# EAGLE design RelayDriverShield (EAGLE 5.10)
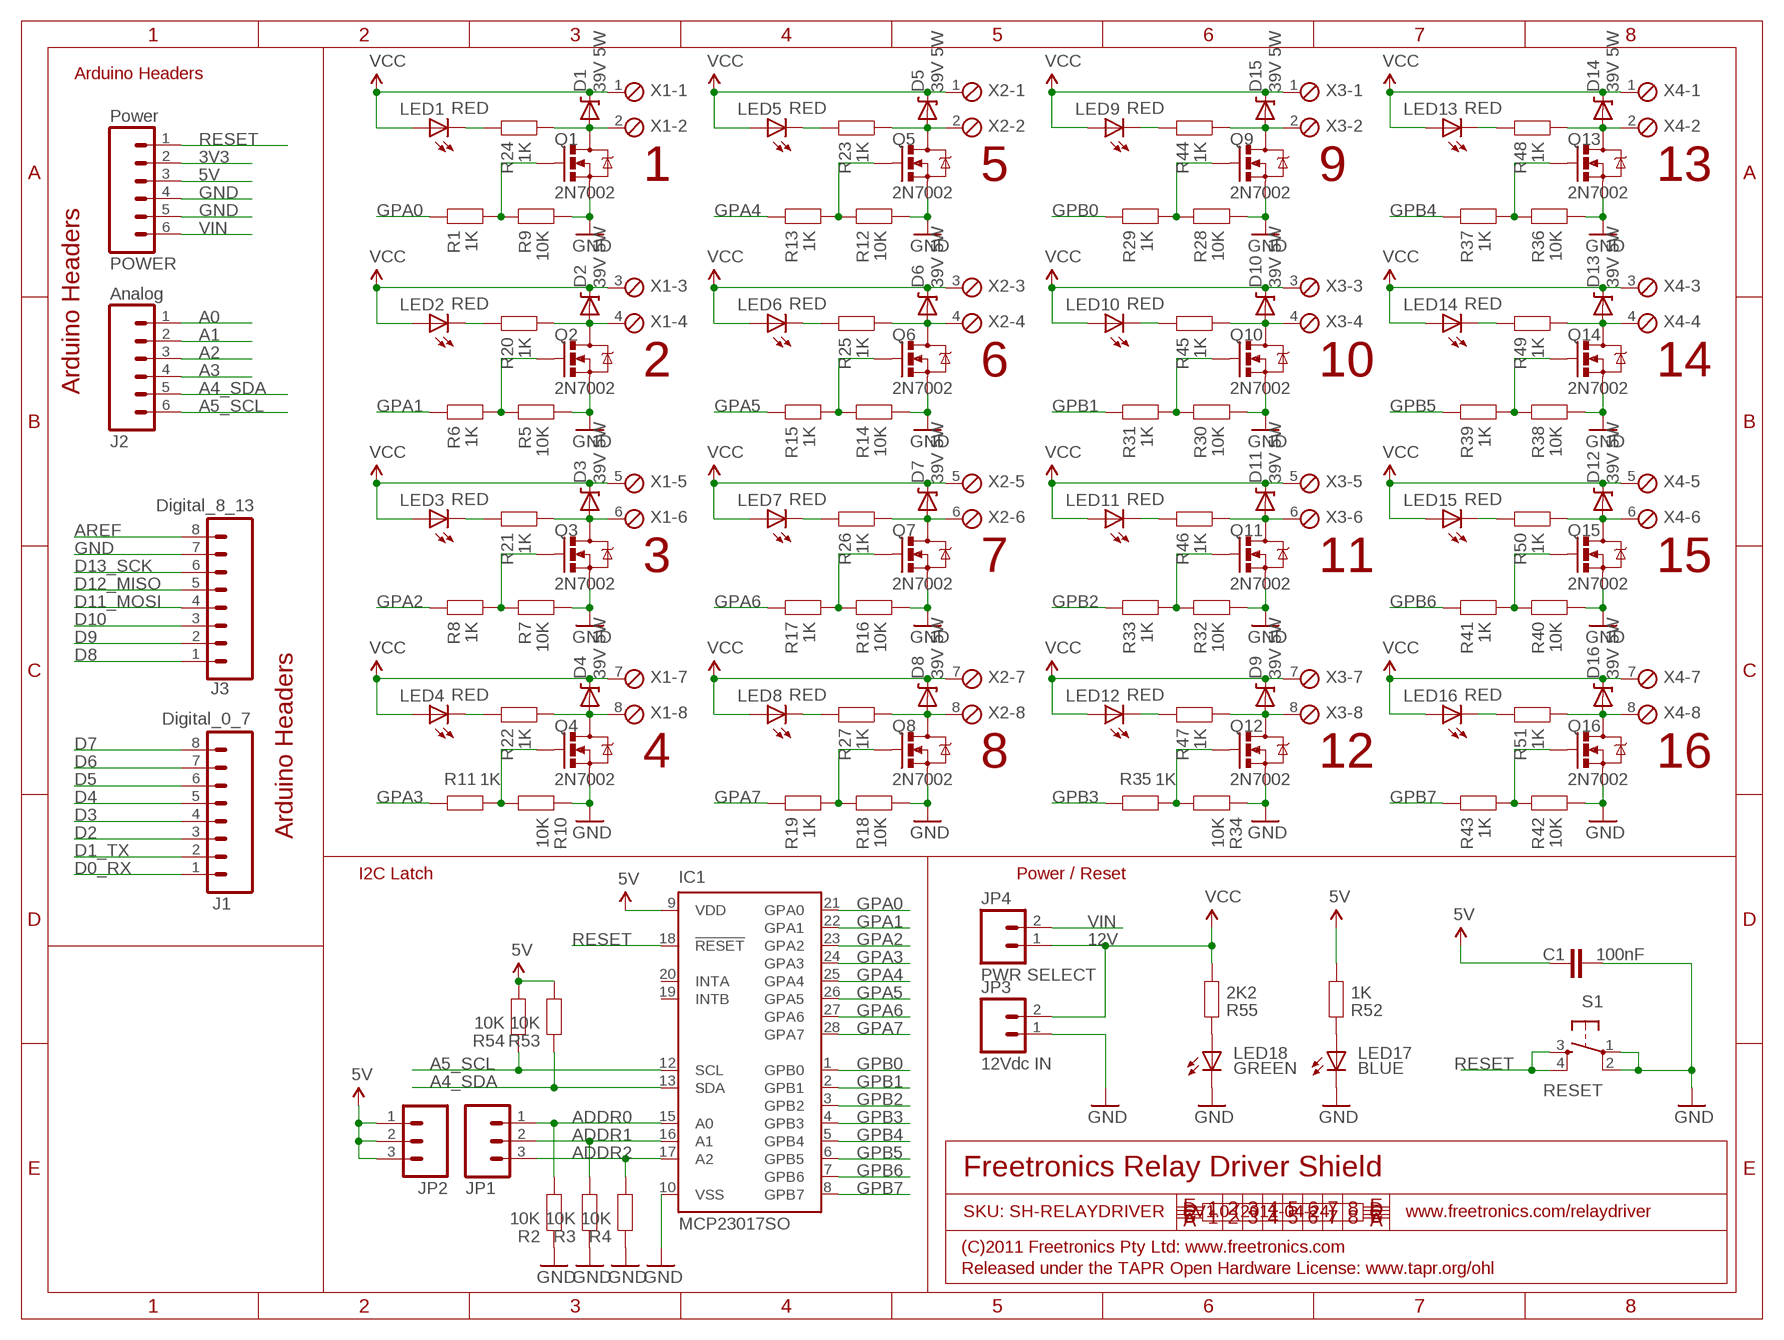
[diagram p0: schematic, sheet 1]

## Parts
C1  100nF  CAP0603  [0603]
D1  39V 5W  DIODE-ZENERSMB  [SMB-DIODE]
D2  39V 5W  DIODE-ZENERSMB  [SMB-DIODE]
D3  39V 5W  DIODE-ZENERSMB  [SMB-DIODE]
D4  39V 5W  DIODE-ZENERSMB  [SMB-DIODE]
D5  39V 5W  DIODE-ZENERSMB  [SMB-DIODE]
D6  39V 5W  DIODE-ZENERSMB  [SMB-DIODE]
D7  39V 5W  DIODE-ZENERSMB  [SMB-DIODE]
D8  39V 5W  DIODE-ZENERSMB  [SMB-DIODE]
D9  39V 5W  DIODE-ZENERSMB  [SMB-DIODE]
D10  39V 5W  DIODE-ZENERSMB  [SMB-DIODE]
D11  39V 5W  DIODE-ZENERSMB  [SMB-DIODE]
D12  39V 5W  DIODE-ZENERSMB  [SMB-DIODE]
D13  39V 5W  DIODE-ZENERSMB  [SMB-DIODE]
D14  39V 5W  DIODE-ZENERSMB  [SMB-DIODE]
D15  39V 5W  DIODE-ZENERSMB  [SMB-DIODE]
D16  39V 5W  DIODE-ZENERSMB  [SMB-DIODE]
IC1  MCP23017SO  [SO28W]
J1  Digital_0_7  M08  [1X08]
J2  Analog  M06SIP  [1X06]
J3  Digital_8_13  M08  [1X08]
JP1  M03PTH  [1X03]
JP2  M03PTH  [1X03]
JP3  12Vdc IN  M025MM  [SCREWTERMINAL-5MM-2]
JP4  PWR SELECT  M02PTH  [1X02]
LED1  RED  LED0603  [LED-0603]
LED2  RED  LED0603  [LED-0603]
LED3  RED  LED0603  [LED-0603]
LED4  RED  LED0603  [LED-0603]
LED5  RED  LED0603  [LED-0603]
LED6  RED  LED0603  [LED-0603]
LED7  RED  LED0603  [LED-0603]
LED8  RED  LED0603  [LED-0603]
LED9  RED  LED0603  [LED-0603]
LED10  RED  LED0603  [LED-0603]
LED11  RED  LED0603  [LED-0603]
LED12  RED  LED0603  [LED-0603]
LED13  RED  LED0603  [LED-0603]
LED14  RED  LED0603  [LED-0603]
LED15  RED  LED0603  [LED-0603]
LED16  RED  LED0603  [LED-0603]
LED17  BLUE  LED0603  [LED-0603]
LED18  GREEN  LED0603  [LED-0603]
POWER  Power  M06SIP  [1X06]
Q1  2N7002  MOSFET-NCHANNELSMD  [SOT23-3]
Q2  2N7002  MOSFET-NCHANNELSMD  [SOT23-3]
Q3  2N7002  MOSFET-NCHANNELSMD  [SOT23-3]
Q4  2N7002  MOSFET-NCHANNELSMD  [SOT23-3]
Q5  2N7002  MOSFET-NCHANNELSMD  [SOT23-3]
Q6  2N7002  MOSFET-NCHANNELSMD  [SOT23-3]
Q7  2N7002  MOSFET-NCHANNELSMD  [SOT23-3]
Q8  2N7002  MOSFET-NCHANNELSMD  [SOT23-3]
Q9  2N7002  MOSFET-NCHANNELSMD  [SOT23-3]
Q10  2N7002  MOSFET-NCHANNELSMD  [SOT23-3]
Q11  2N7002  MOSFET-NCHANNELSMD  [SOT23-3]
Q12  2N7002  MOSFET-NCHANNELSMD  [SOT23-3]
Q13  2N7002  MOSFET-NCHANNELSMD  [SOT23-3]
Q14  2N7002  MOSFET-NCHANNELSMD  [SOT23-3]
Q15  2N7002  MOSFET-NCHANNELSMD  [SOT23-3]
Q16  2N7002  MOSFET-NCHANNELSMD  [SOT23-3]
R1  1K  RESISTOR0603  [0603]
R2  10K  RESISTOR0603  [0603]
R3  10K  RESISTOR0603  [0603]
R4  10K  RESISTOR0603  [0603]
R5  10K  RESISTOR0603  [0603]
R6  1K  RESISTOR0603  [0603]
R7  10K  RESISTOR0603  [0603]
R8  1K  RESISTOR0603  [0603]
R9  10K  RESISTOR0603  [0603]
R10  10K  RESISTOR0603  [0603]
R11  1K  RESISTOR0603  [0603]
R12  10K  RESISTOR0603  [0603]
R13  1K  RESISTOR0603  [0603]
R14  10K  RESISTOR0603  [0603]
R15  1K  RESISTOR0603  [0603]
R16  10K  RESISTOR0603  [0603]
R17  1K  RESISTOR0603  [0603]
R18  10K  RESISTOR0603  [0603]
R19  1K  RESISTOR0603  [0603]
R20  1K  RESISTOR0603  [0603]
R21  1K  RESISTOR0603  [0603]
R22  1K  RESISTOR0603  [0603]
R23  1K  RESISTOR0603  [0603]
R24  1K  RESISTOR0603  [0603]
R25  1K  RESISTOR0603  [0603]
R26  1K  RESISTOR0603  [0603]
R27  1K  RESISTOR0603  [0603]
R28  10K  RESISTOR0603  [0603]
R29  1K  RESISTOR0603  [0603]
R30  10K  RESISTOR0603  [0603]
R31  1K  RESISTOR0603  [0603]
R32  10K  RESISTOR0603  [0603]
R33  1K  RESISTOR0603  [0603]
R34  10K  RESISTOR0603  [0603]
R35  1K  RESISTOR0603  [0603]
R36  10K  RESISTOR0603  [0603]
R37  1K  RESISTOR0603  [0603]
R38  10K  RESISTOR0603  [0603]
R39  1K  RESISTOR0603  [0603]
R40  10K  RESISTOR0603  [0603]
R41  1K  RESISTOR0603  [0603]
R42  10K  RESISTOR0603  [0603]
R43  1K  RESISTOR0603  [0603]
R44  1K  RESISTOR0603  [0603]
R45  1K  RESISTOR0603  [0603]
R46  1K  RESISTOR0603  [0603]
R47  1K  RESISTOR0603  [0603]
R48  1K  RESISTOR0603  [0603]
R49  1K  RESISTOR0603  [0603]
R50  1K  RESISTOR0603  [0603]
R51  1K  RESISTOR0603  [0603]
R52  1K  RESISTOR0603  [0603]
R53  10K  RESISTOR0603  [0603]
R54  10K  RESISTOR0603  [0603]
R55  2K2  RESISTOR0603  [0603]
S1  RESET  TAC_SWITCHSMD  [TACTILE_SWITCH_SMD]
X1  MPT8  [8POL254]
X2  MPT8  [8POL254]
X3  MPT8  [8POL254]
X4  MPT8  [8POL254]

## Nets
3V3: POWER.2
5V: C1.1 IC1.9(VDD) JP2.1 JP2.2 JP2.3 POWER.3 R52.2 R53.2 R54.2
12V: D1.C D2.C D3.C D4.C D5.C D6.C D7.C D8.C D9.C D10.C D11.C D12.C D13.C D14.C D15.C D16.C JP3.2 JP4.1 LED1.A LED2.A LED3.A LED4.A LED5.A LED6.A LED7.A LED8.A LED9.A LED10.A LED11.A LED12.A LED13.A LED14.A LED15.A LED16.A R55.2 X1.1 X1.3 X1.5 X1.7 X2.1 X2.3 X2.5 X2.7 X3.1 X3.3 X3.5 X3.7 X4.1 X4.3 X4.5 X4.7 ; supply symbol labelled VCC
A0: J2.1
A1: J2.2
A2: J2.3
A3: J2.4
A4_SDA: IC1.13(SDA) J2.5 R53.1
A5_SCL: IC1.12(SCL) J2.6 R54.1
ADDR0: IC1.15(A0) JP1.1 R2.2
ADDR1: IC1.16(A1) JP1.2 R3.2
ADDR2: IC1.17(A2) JP1.3 R4.2
AREF: J3.8
D0_RX: J1.1
D1_TX: J1.2
D2: J1.3
D3: J1.4
D4: J1.5
D5: J1.6
D6: J1.7
D7: J1.8
D8: J3.1
D9: J3.2
D10: J3.3
D11_MOSI: J3.4
D12_MISO: J3.5
D13_SCK: J3.6
GND: C1.2 IC1.10(VSS) J3.7 JP3.1 LED17.C LED18.C POWER.4 POWER.5 Q1.2(S) Q2.2(S) Q3.2(S) Q4.2(S) Q5.2(S) Q6.2(S) Q7.2(S) Q8.2(S) Q9.2(S) Q10.2(S) Q11.2(S) Q12.2(S) Q13.2(S) Q14.2(S) Q15.2(S) Q16.2(S) R2.1 R3.1 R4.1 R5.1 R7.1 R9.1 R10.1 R12.1 R14.1 R16.1 R18.1 R28.1 R30.1 R32.1 R34.1 R36.1 R38.1 R40.1 R42.1 S1.1 S1.2
GPA0: IC1.21(GPA0) R1.2
GPA1: IC1.22(GPA1) R6.2
GPA2: IC1.23(GPA2) R8.2
GPA3: IC1.24(GPA3) R11.2
GPA4: IC1.25(GPA4) R13.2
GPA5: IC1.26(GPA5) R15.2
GPA6: IC1.27(GPA6) R17.2
GPA7: IC1.28(GPA7) R19.2
GPB0: IC1.1(GPB0) R29.2
GPB1: IC1.2(GPB1) R31.2
GPB2: IC1.3(GPB2) R33.2
GPB3: IC1.4(GPB3) R35.2
GPB4: IC1.5(GPB4) R37.2
GPB5: IC1.6(GPB5) R39.2
GPB6: IC1.7(GPB6) R41.2
GPB7: IC1.8(GPB7) R43.2
N$1: Q1.1(G) R1.1 R9.2
N$2: D15.A Q9.3(D) R44.2 X3.2
N$3: D2.A Q2.3(D) R20.2 X1.4
N$4: LED18.A R55.1
N$5: D1.A Q1.3(D) R24.2 X1.2
N$8: Q2.1(G) R5.2 R6.1
N$9: D3.A Q3.3(D) R21.2 X1.6
N$10: Q3.1(G) R7.2 R8.1
N$11: D4.A Q4.3(D) R22.2 X1.8
N$12: Q4.1(G) R10.2 R11.1
N$13: D5.A Q5.3(D) R23.2 X2.2
N$14: Q5.1(G) R12.2 R13.1
N$15: D6.A Q6.3(D) R25.2 X2.4
N$16: Q6.1(G) R14.2 R15.1
N$17: D7.A Q7.3(D) R26.2 X2.6
N$18: Q7.1(G) R16.2 R17.1
N$19: D8.A Q8.3(D) R27.2 X2.8
N$20: Q8.1(G) R18.2 R19.1
N$21: LED2.C R20.1
N$22: LED4.C R22.1
N$23: LED3.C R21.1
N$24: LED1.C R24.1
N$25: LED5.C R23.1
N$26: LED6.C R25.1
N$27: LED7.C R26.1
N$28: LED8.C R27.1
N$29: Q9.1(G) R28.2 R29.1
N$30: D10.A Q10.3(D) R45.2 X3.4
N$31: Q10.1(G) R30.2 R31.1
N$32: D11.A Q11.3(D) R46.2 X3.6
N$33: Q11.1(G) R32.2 R33.1
N$34: D9.A Q12.3(D) R47.2 X3.8
N$35: Q12.1(G) R34.2 R35.1
N$36: D14.A Q13.3(D) R48.2 X4.2
N$37: Q13.1(G) R36.2 R37.1
N$38: D13.A Q14.3(D) R49.2 X4.4
N$39: Q14.1(G) R38.2 R39.1
N$40: D12.A Q15.3(D) R50.2 X4.6
N$41: Q15.1(G) R40.2 R41.1
N$42: D16.A Q16.3(D) R51.2 X4.8
N$43: Q16.1(G) R42.2 R43.1
N$44: LED9.C R44.1
N$45: LED10.C R45.1
N$46: LED11.C R46.1
N$47: LED12.C R47.1
N$48: LED13.C R48.1
N$49: LED14.C R49.1
N$50: LED16.C R51.1
N$51: LED15.C R50.1
N$52: LED17.A R52.1
RESET: IC1.18(!RESET) POWER.1 S1.3 S1.4
VIN: JP4.2 POWER.6
Unconnected: IC1.19(INTB) IC1.20(INTA)

## Notes on the sheet
- Arduino Headers
- 1 | 5 | 9 | 13
- 2 | 6 | 10 | 14
- Arduino Headers
- 3 | 7 | 11 | 15
- 4 | 8 | 12 | 16
- Arduino Headers
- I2C Latch | Power / Reset
- Freetronics Relay Driver Shield
- SKU: SH-RELAYDRIVER | V1.0 (2011-04-24) | www.freetronics.com/relaydriver
- (C)2011 Freetronics Pty Ltd: www.freetronics.com
- Released under the TAPR Open Hardware License: www.tapr.org/ohl

## Library data of the parts
C1 = freetronics-original:CAP: Capacitor Standard 0603 ceramic capacitor, and 0.1" leaded capacitor.
D1-D16 = freetronics-original:DIODE-ZENER
IC1 = microchip:MCP23017: http://ww1.microchip.com/downloads/en/DeviceDoc/21952a.pdf Source: http://ww1.microchip.com/downloads/en/DeviceDoc/21952a.pdf
J1 J3 = freetronics:M08: Header 8 Standard 8-pin 0.1" header. Use with straight break away headers (SKU : PRT-00116), right angle break away headers (PRT-00553), swiss pins (PRT-00743), machine pins (PRT-00117), and female headers (PRT-00115).
J2 POWER = freetronics:M06: Header 6 Standard 6-pin 0.1" header. Use with straight break away headers (SKU : PRT-00116), right angle break away headers (PRT-00553), swiss pins (PRT-00743), machine pins (PRT-00117), and female headers (PRT-00115). Molex polarized connector foot print use with SKU : PRT-08094 with associated crimp pins and housings. NOTES ON THE VARIANTS LOCK and LOCK_LONGPADS... This footprint was designed to help hold the alignment of a through-hole component (i.e. 6-pin header) while soldering it into place. You may notice that each hole has been shifted either up or down by 0.005 of an inch from it's more standard position (which is a perfectly straight line). This slight alteration caused the pins (the squares in the middle) to touch the edges of the holes. Because they are alternating, it causes a "brace" to hold the component in place. 0.005 has proven to be the perfect amount of "off-center" position when using our standard breakaway headers. Although looks a little odd when you look at the bare footprint, once you have a header in there, the alteration is very hard to notice. Also, if you push a header all the way into place, it is covered up entirely on the bottom side. This idea of altering the position of holes to aid alignment will be further integrated into the Sparkfun Library for other footprints. It can help hold any component with 3 or more connection pins.
JP1 JP2 = freetronics-original:M03: Header 3 Standard 3-pin 0.1" header. Use with straight break away headers (SKU : PRT-00116), right angle break away headers (PRT-00553), swiss pins (PRT-00743), machine pins (PRT-00117), and female headers (PRT-00115). Molex polarized connector foot print use with SKU : PRT-08232 with associated crimp pins and housings.
JP3 = freetronics-original:M02: Header 2 Standard 2-pin 0.1" header. Use with straight break away headers (SKU : PRT-00116), right angle break away headers (PRT-00553), swiss pins (PRT-00743), machine pins (PRT-00117), and female headers (PRT-00115). Molex polarized connector foot print use with SKU : PRT-08233 with associated crimp pins and housings.
JP4 = SparkFun:M02: Header 2 Standard 2-pin 0.1" header. Use with straight break away headers (SKU : PRT-00116), right angle break away headers (PRT-00553), swiss pins (PRT-00743), machine pins (PRT-00117), and female headers (PRT-00115). Molex polarized connector foot print use with SKU : PRT-08233 with associated crimp pins and housings.
LED1-LED18 = freetronics-master-v1:LED: LEDs Standard schematic elements and footprints for 5mm, 3mm, 1206, and 0603 sized LEDs. 5mm - Spark Fun Electronics SKU : COM-00529 (and others)
Q1-Q16 = freetronics-master-v1:MOSFET-NCHANNEL
R1-R55 = freetronics-master-v1:RESISTOR: Resistor Basic schematic elements and footprints for 0603, 1206, and PTH 1/10th watt (small) resistors.
S1 = freetronics-original:TAC_SWITCH: Momentary Switch Button commonly used for reset or general input. Spark Fun Electronics SKU : COM-00097
X1-X4 = con-phoenix-254:MPT8: PHOENIX CONNECTOR

## Board
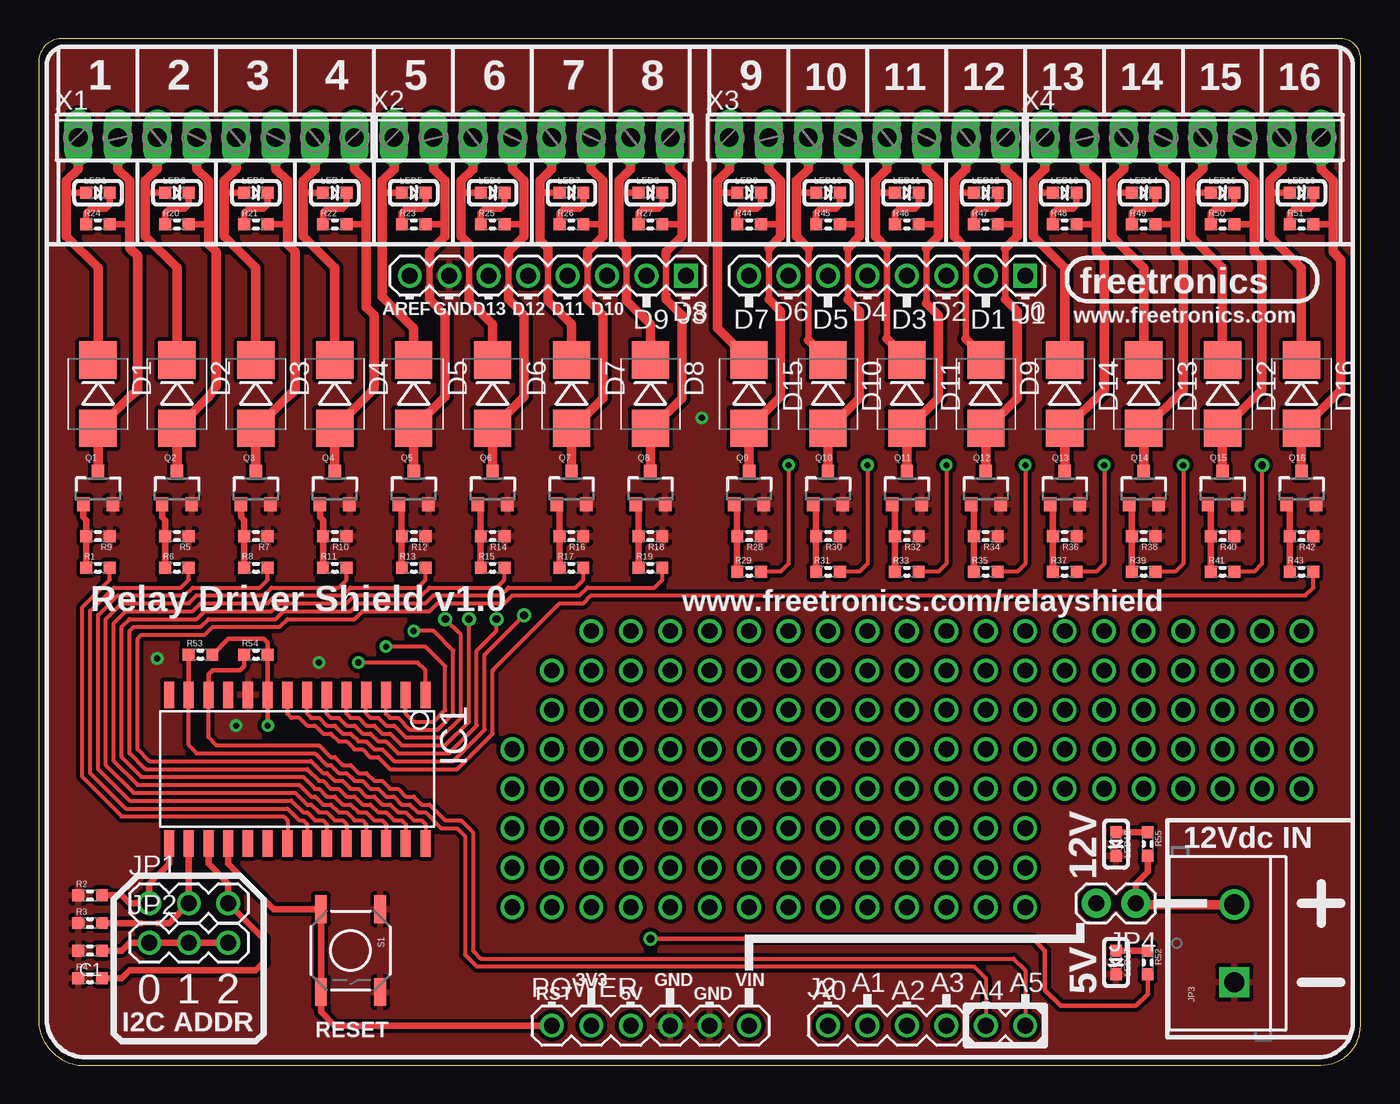
[diagram p1: board, top side]
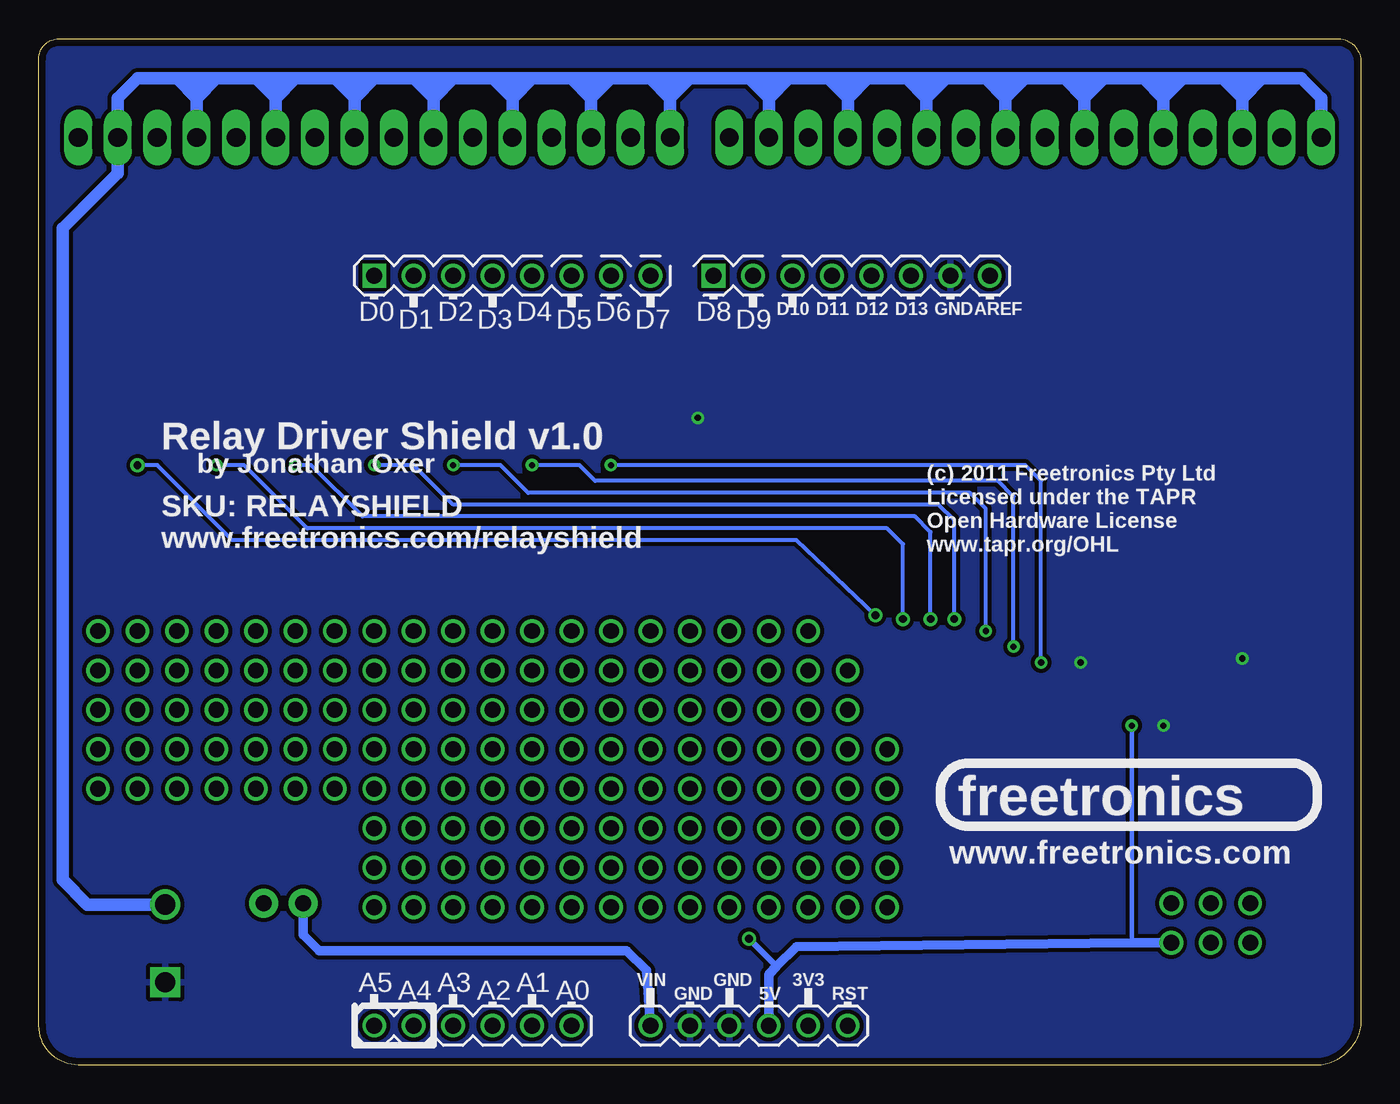
[diagram p2: board, bottom side, seen from below]

Size 85.09 x 66.04 mm. Coordinates in mm from the lower left corner, seen from the top.
Outline: 0,2.54 arc74 2.54,0 82.55,0 arc90 85.09,2.54 85.09,64.77 arc90 83.82,66.04 1.27,66.04 arc74 0,64.77 0,2.54
Copper layers (1*16): Top 0.035mm / dielectric 1.5mm / Bottom 0.035mm
Design rules "default *": minimum track width 10mil, minimum drill 24mil, track to track 10mil, track to pad 12mil, pad to pad 12mil, via to via 12mil, smd to smd 8mil, copper to edge 18mil, drill to drill 8mil, minimum pad ring 10mil, minimum via ring 8mil, stop-mask expansion 4mil, vias tented up to drill 0mil, thermal gap 10mil

### Footprints (pad centres in the part's own frame; a part is rotated, then mirrored left to right if it is on the bottom)
0603 = smd 0.762 x 0.762: 1 -0.762,0; 2 0.762,0
SMB-DIODE = smd 2.4 x 2.4: A 2.2,0; C -2.2,0
SO28W = smd 0.65 x 1.7: 1 -7.62,-4.78; 2 -6.35,-4.78; 3 -5.08,-4.78; 4 -3.81,-4.78; 5 -2.54,-4.78; 6 -1.27,-4.78; 7 0,-4.78; 8 1.27,-4.78; 9 2.54,-4.78; 10 3.81,-4.78; 11 5.08,-4.78; 12 6.35,-4.78; 13 7.62,-4.78; 14 8.89,-4.78; 15 8.89,4.78; 16 7.62,4.78; 17 6.35,4.78; 18 5.08,4.78; 19 3.81,4.78; 20 2.54,4.78; 21 1.27,4.78; 22 0,4.78; 23 -1.27,4.78; 24 -2.54,4.78; 25 -3.81,4.78; 26 -5.08,4.78; 27 -6.35,4.78; 28 -7.62,4.78
1X08 = drill 1.016 square: 1 0,0 | drill 1.016 round: 2 2.54,0; 3 5.08,0; 4 7.62,0; 5 10.16,0; 6 12.7,0; 7 15.24,0; 8 17.78,0
1X06 = drill 1.016 round: 1 0,0; 2 2.54,0; 3 5.08,0; 4 7.62,0; 5 10.16,0; 6 12.7,0
1X03 = drill 1.016 round: 1 0,0; 2 2.54,0; 3 5.08,0
SCREWTERMINAL-5MM-2 = drill 1.3 square: 1 0,0 | drill 1.3 round: 2 5,0
1X02 = drill 1.016 pad 1.88 round: 1 0,0; 2 2.54,0
LED-0603 = smd 0.762 x 0.762: A -0.762,0; C 0.762,0
SOT23-3 = smd 0.8 x 0.9: 1 -0.95,-1; 2 0.95,-1; 3 0,1.1
TACTILE_SWITCH_SMD = smd 1.778 x 0.762: 1 -2.667,1.905; 2 2.667,1.905; 3 -2.667,-1.905; 4 2.667,-1.905
8POL254 = drill 1.2 long: 1 -8.89,0; 2 -6.35,0; 3 -3.81,0; 4 -1.27,0; 5 1.27,0; 6 3.81,0; 7 6.35,0; 8 8.89,0

### Placement (x,y rotation side)
C1  3.3,7.37 180 top
D1  3.81,43.18 270 top
D2  8.89,43.18 270 top
D3  13.97,43.18 270 top
D4  19.05,43.18 270 top
D5  24.13,43.18 270 top
D6  29.21,43.18 270 top
D7  34.29,43.18 270 top
D8  39.37,43.18 270 top
D9  60.96,43.18 270 top
D10  50.8,43.18 270 top
D11  55.88,43.18 270 top
D12  76.2,43.18 270 top
D13  71.12,43.18 270 top
D14  66.04,43.18 270 top
D15  45.72,43.18 270 top
D16  81.28,43.18 270 top
IC1  17.27,19.05 180 top
J1  63.5,50.8 180 top
J2  50.8,2.54 0 top
J3  41.66,50.8 180 top
JP1  7.11,10.41 0 top
JP2  7.11,7.87 0 top
JP3  76.96,5.33 90 top
JP4  70.61,10.41 180 top
LED1  3.81,56.13 0 top
LED2  8.89,56.13 0 top
LED3  13.97,56.13 0 top
LED4  19.05,56.13 0 top
LED5  24.13,56.13 0 top
LED6  29.21,56.13 0 top
LED7  34.29,56.13 0 top
LED8  39.37,56.13 0 top
LED9  45.72,56.13 0 top
LED10  50.8,56.13 0 top
LED11  55.88,56.13 0 top
LED12  60.96,56.13 0 top
LED13  66.04,56.13 0 top
LED14  71.12,56.13 0 top
LED15  76.2,56.13 0 top
LED16  81.28,56.13 0 top
LED17  69.34,6.6 270 top
LED18  69.34,14.22 270 top
POWER  33.02,2.54 0 top
Q1  3.81,37.08 0 top
Q2  8.89,37.08 0 top
Q3  13.97,37.08 0 top
Q4  19.05,37.08 0 top
Q5  24.13,37.08 0 top
Q6  29.21,37.08 0 top
Q7  34.29,37.08 0 top
Q8  39.37,37.08 0 top
Q9  45.72,37.08 0 top
Q10  50.8,37.08 0 top
Q11  55.88,37.08 0 top
Q12  60.96,37.08 0 top
Q13  66.04,37.08 0 top
Q14  71.12,37.08 0 top
Q15  76.2,37.08 0 top
Q16  81.28,37.08 0 top
R1  3.81,32 0 top
R2  3.3,10.92 0 top
R3  3.3,9.14 0 top
R4  3.3,5.59 0 top
R5  8.89,34.04 180 top
R6  8.89,32 0 top
R7  13.97,34.04 180 top
R8  13.97,32 0 top
R9  3.81,34.04 180 top
R10  19.05,34.04 180 top
R11  19.05,32 0 top
R12  24.13,34.04 180 top
R13  24.13,32 0 top
R14  29.21,34.04 180 top
R15  29.21,32 0 top
R16  34.29,34.04 180 top
R17  34.29,32 0 top
R18  39.37,34.04 180 top
R19  39.37,32 0 top
R20  8.89,54.1 0 top
R21  13.97,54.1 0 top
R22  19.05,54.1 0 top
R23  24.13,54.1 0 top
R24  3.81,54.1 0 top
R25  29.21,54.1 0 top
R26  34.29,54.1 0 top
R27  39.37,54.1 0 top
R28  45.72,34.04 180 top
R29  45.72,31.75 0 top
R30  50.8,34.04 180 top
R31  50.8,31.75 0 top
R32  55.88,34.04 180 top
R33  55.88,31.75 0 top
R34  60.96,34.04 180 top
R35  60.96,31.75 0 top
R36  66.04,34.04 180 top
R37  66.04,31.75 0 top
R38  71.12,34.04 180 top
R39  71.12,31.75 0 top
R40  76.2,34.04 180 top
R41  76.2,31.75 0 top
R42  81.28,34.04 180 top
R43  81.28,31.75 0 top
R44  45.72,54.1 0 top
R45  50.8,54.1 0 top
R46  55.88,54.1 0 top
R47  60.96,54.1 0 top
R48  66.04,54.1 0 top
R49  71.12,54.1 0 top
R50  76.2,54.1 0 top
R51  81.28,54.1 0 top
R52  71.37,6.6 270 top
R53  10.41,26.42 0 top
R54  13.97,26.42 0 top
R55  71.37,14.22 270 top
S1  20.07,7.37 270 top
X1  11.43,59.69 0 top
X2  31.75,59.69 0 top
X3  53.34,59.69 0 top
X4  73.66,59.69 0 top

### Tracks (layer width: path | path; a pad name or v marks a point on that pad's centre or on a via)
5V  (via drill 0.4, 0.5)
  Top 0.305: R53.2 12.19,27.43 14.48,27.43 14.73,27.18 R54.2 IC1.9 v14.73,21.84 | v39.37,8.13 64.01,8.13 64.77,7.37 64.77,4.83 65.79,3.81 70.61,3.81 71.37,4.57 R52.2
  Top 0.406: JP2.3 JP2.2 JP2.1 5.84,7.87 5.33,7.37 C1.1
  Bottom 0.305: 14.73,7.87 v14.73,21.84
  Bottom 0.406: 37.59,6.35 v39.37,8.13
  Bottom 0.61: JP2.3 14.73,7.87 36.32,7.62 37.59,6.35 38.1,5.84 POWER.3
12V
  Top 0.406: 1.78,56.13 LED1.A | 6.86,56.13 LED2.A | 11.94,56.13 LED3.A | 17.02,56.13 LED4.A | 22.1,56.13 LED5.A | 27.18,56.13 LED6.A | 49.53,52.58 49.53,46.65 | 54.61,52.58 54.61,46.74 | 59.69,52.58 59.69,46.74 | 79.25,56.13 LED16.A | 74.17,56.13 LED15.A | 69.09,56.13 LED14.A | 64.01,56.13 LED13.A | 58.93,56.13 LED12.A | 53.85,56.13 LED11.A | 48.77,56.13 LED10.A | 43.69,56.13 LED9.A | 37.34,56.13 LED8.A | 32.26,56.13 LED7.A | 37.85,51.56 37.85,50.04 | 32.77,51.56 32.77,50.04 | 27.69,51.56 27.69,50.04 | R55.2 71.37,12.45 70.61,11.68 JP4.1
  Top 0.61: 3.81,45.72 D1.C 3.81,51.31 1.78,53.34 1.78,56.13 1.78,56.9 2.54,57.66 X1.1 | X1.3 7.62,57.66 6.86,56.9 6.86,56.13 6.86,53.34 8.89,51.31 D2.C | X1.5 12.7,57.66 11.94,56.9 11.94,56.13 11.94,53.34 13.97,51.31 D3.C | X1.7 17.78,57.66 17.02,56.9 17.02,56.13 17.02,53.34 19.05,51.31 D4.C | X2.1 22.86,57.66 22.1,56.9 22.1,56.13 22.1,49.44 24.13,47.41 D5.C | X2.3 27.94,57.66 27.18,56.9 27.18,56.13 27.18,53.34 27.69,52.83 27.69,51.56 | X2.7 38.1,57.66 37.34,56.9 37.34,56.13 37.34,53.09 37.85,52.58 37.85,51.56 | D15.C 43.69,47.41 43.69,56.13 43.69,56.9 44.45,57.66 X3.1 | X2.5 33.02,57.66 32.26,56.9 32.26,56.13 32.26,53.09 32.77,52.58 32.77,51.56 | X3.3 49.53,57.66 48.77,56.9 48.77,56.13 48.77,53.34 49.53,52.58 | 49.53,46.65 D10.C | X3.5 54.61,57.66 53.85,56.9 53.85,56.13 53.85,53.34 54.61,52.58 | 54.61,46.74 55.88,45.47 D11.C | X3.7 59.69,57.66 58.93,56.9 58.93,56.13 58.93,53.34 59.69,52.58 | 59.69,46.74 60.96,45.47 D9.C | X4.1 64.77,57.66 64.01,56.9 64.01,56.13 64.01,53.34 66.04,51.31 D14.C | X4.3 69.85,57.66 69.09,56.9 69.09,56.13 69.09,53.34 71.12,51.31 D13.C | X4.5 74.93,57.66 74.17,56.9 74.17,56.13 74.17,53.34 76.2,51.31 D12.C | X4.7 80.01,57.66 79.25,56.9 79.25,56.13 79.25,53.34 81.28,51.31 D16.C | D6.C 29.21,47.67 27.69,49.19 27.69,50.04 | D7.C 34.29,47.67 32.77,49.19 32.77,50.04 | D8.C 39.37,47.67 37.85,49.19 37.85,50.04 | JP4.1 70.69,10.33 JP3.2
  Bottom 0.813: X1.1 2.54,62.23 3.81,63.5 6.35,63.5 | 6.35,63.5 7.62,62.23 | 7.62,62.23 X1.3 | 7.62,62.23 8.89,63.5 11.43,63.5 12.7,62.23 | 12.7,62.23 X1.5 | 12.7,62.23 13.97,63.5 16.51,63.5 17.78,62.23 | 17.78,62.23 X1.7 | 17.78,62.23 19.05,63.5 21.59,63.5 22.86,62.23 | 22.86,62.23 X2.1 | 22.86,62.23 24.13,63.5 26.67,63.5 27.94,62.23 | 27.94,62.23 X2.3 | 27.94,62.23 29.21,63.5 31.75,63.5 33.02,62.23 | 33.02,62.23 X2.5 | 33.02,62.23 34.29,63.5 36.83,63.5 38.1,62.23 | 38.1,62.23 X2.7 | 38.1,62.23 39.37,63.5 43.18,63.5 44.45,62.23 | 44.45,62.23 X3.1 | 44.45,62.23 45.72,63.5 48.26,63.5 49.53,62.23 | 49.53,62.23 X3.3 | 49.53,62.23 50.8,63.5 53.34,63.5 54.61,62.23 | 54.61,62.23 X3.5 | 54.61,62.23 55.88,63.5 58.42,63.5 59.69,62.23 | 59.69,62.23 X3.7 | 59.69,62.23 60.96,63.5 63.5,63.5 64.77,62.23 | 64.77,62.23 X4.1 | 64.77,62.23 66.04,63.5 68.58,63.5 69.85,62.23 | 69.85,62.23 X4.3 | 69.85,62.23 71.12,63.5 73.66,63.5 74.93,62.23 | 74.93,62.23 X4.5 | 76.2,63.5 74.93,62.23 | 76.2,63.5 78.74,63.5 80.01,62.23 X4.7 80.01,57.4 83.57,53.85 83.57,11.94 81.96,10.33 JP3.2 | 6.35,63.5 7.62,63.5 | 7.62,63.5 12.7,63.5 | 12.7,63.5 17.78,63.5 | 17.78,63.5 22.86,63.5 | 22.86,63.5 27.94,63.5 | 27.94,63.5 33.02,63.5 | 33.02,63.5 38.1,63.5 | 38.1,63.5 44.45,63.5 | 44.45,63.5 49.53,63.5 | 49.53,63.5 54.61,63.5 | 54.61,63.5 59.69,63.5 | 59.69,63.5 64.77,63.5 | 64.77,63.5 69.85,63.5 | 69.85,63.5 74.93,63.5 | 74.93,63.5 76.2,63.5 | 7.62,62.23 7.62,63.5 | 12.7,63.5 12.7,62.23 | 17.78,63.5 17.78,62.23 | 22.86,63.5 22.86,62.23 | 27.94,63.5 27.94,62.23 | 33.02,63.5 33.02,62.23 | 38.1,63.5 38.1,62.23 | 44.45,63.5 44.45,62.23 | 49.53,63.5 49.53,62.23 | 54.61,63.5 54.61,62.23 | 59.69,63.5 59.69,62.23
  Bottom 0.813: 64.77,63.5 64.77,62.23 | 69.85,63.5 69.85,62.23 | 74.93,63.5 74.93,62.23
A4_SDA
  Top 0.254: IC1.13 9.65,20.57 10.16,20.07 17.78,20.07 18.54,19.3 18.8,19.3 19.3,18.8 19.81,18.8 20.32,18.29 20.83,18.29 21.34,17.78 21.84,17.78 22.35,17.27 22.86,17.27 23.37,16.76 23.88,16.76 24.38,16.26 24.89,16.26 25.91,15.24 26.92,15.24 27.43,14.73 27.43,7.11 28.19,6.35 60.2,6.35 60.96,5.59 J2.5
  Top 0.305: IC1.13 R53.1
A5_SCL
  Top 0.254: IC1.12 10.92,21.08 11.43,20.57 18.03,20.57 18.8,19.81 19.05,19.81 19.56,19.3 20.07,19.3 20.57,18.8 21.08,18.8 21.59,18.29 22.1,18.29 22.61,17.78 23.11,17.78 23.62,17.27 24.13,17.27 24.64,16.76 25.15,16.76 26.16,15.75 27.18,15.75 27.94,14.99 27.94,7.37 28.45,6.86 62.74,6.86 63.5,6.1 J2.6
  Top 0.305: IC1.12 10.92,25.15 11.18,25.4 12.95,25.4 13.21,25.65 R54.1
ADDR0
  Top 0.406: IC1.15 8.38,12.95 7.11,11.68 JP1.1 5.84,10.41 5.33,10.92 R2.2
ADDR1
  Top 0.305: 6.6,9.14 7.62,9.14
  Top 0.406: R3.2 6.6,9.14 | 7.62,9.14 8.38,9.14 JP1.2 IC1.16
ADDR2
  Top 0.406: R4.2 5.33,5.59 5.84,6.1 13.97,6.1 14.48,6.6 14.48,8.13 JP1.3 12.19,11.68 10.92,12.95 IC1.17
GND  (via drill 0.4)
  other vias: 12.7,21.84 18.03,25.91 42.67,41.66 7.62,26.16
  pour Bottom: 0,64.77 arc-74 1.27,66.04 83.82,66.04 arc-74 85.09,64.77 85.09,2.54 arc-74 82.55,0 2.54,0 arc-74 0,2.54
  pour Top: 0,64.77 arc-74 1.27,66.04 83.82,66.04 arc-74 85.09,64.77 85.09,2.54 arc-74 82.55,0 2.54,0 arc-74 0,2.54
GPA0
  Top 0.254: IC1.21 16,15.75 15.75,16 5.33,16 2.79,18.54 2.79,29.46 4.57,31.24 R1.2
GPA1
  Top 0.254: IC1.22 17.27,15.49 17.02,15.75 16.76,15.75 16,16.51 5.59,16.51 3.3,18.8 3.3,29.21 4.83,30.73 9.14,30.73 9.65,31.24 R6.2
GPA2
  Top 0.254: IC1.23 18.54,15.49 18.29,15.75 17.78,15.75 17.27,16.26 17.02,16.26 16.26,17.02 5.84,17.02 3.81,19.05 3.81,28.96 5.08,30.23 9.4,30.23 9.91,30.73 14.22,30.73 14.73,31.24 R8.2
GPA3
  Top 0.254: IC1.24 19.81,15.49 19.56,15.75 19.05,15.75 18.54,16.26 18.03,16.26 17.53,16.76 17.27,16.76 16.51,17.53 6.1,17.53 4.32,19.3 4.32,28.7 5.33,29.72 9.65,29.72 10.16,30.23 14.48,30.23 14.99,30.73 19.3,30.73 19.81,31.24 R11.2
GPA4
  Top 0.254: IC1.25 21.08,15.49 20.83,15.75 20.32,15.75 19.81,16.26 19.3,16.26 18.8,16.76 18.29,16.76 17.78,17.27 17.53,17.27 16.76,18.03 6.35,18.03 4.83,19.56 4.83,28.45 5.59,29.21 9.91,29.21 10.41,29.72 14.73,29.72 15.24,30.23 19.56,30.23 20.07,30.73 24.38,30.73 24.89,31.24 R13.2
GPA5
  Top 0.254: IC1.26 22.35,15.49 22.1,15.75 21.59,15.75 21.08,16.26 20.57,16.26 20.07,16.76 19.56,16.76 19.05,17.27 18.54,17.27 18.03,17.78 17.78,17.78 17.02,18.54 6.6,18.54 5.33,19.81 5.33,28.19 5.84,28.7 10.16,28.7 10.67,29.21 14.99,29.21 15.49,29.72 19.81,29.72 20.32,30.23 24.64,30.23 25.15,30.73 29.46,30.73 29.97,31.24 R15.2
GPA6
  Top 0.254: IC1.27 23.62,15.49 23.37,15.75 22.86,15.75 22.35,16.26 21.84,16.26 21.34,16.76 20.83,16.76 20.32,17.27 19.81,17.27 19.3,17.78 18.8,17.78 18.29,18.29 18.03,18.29 17.27,19.05 6.86,19.05 5.84,20.07 5.84,27.94 6.1,28.19 10.41,28.19 10.92,28.7 15.24,28.7 15.75,29.21 20.07,29.21 20.57,29.72 24.89,29.72 25.4,30.23 29.72,30.23 30.23,30.73 34.54,30.73 35.05,31.24 R17.2
GPA7
  Top 0.254: IC1.28 24.89,15.49 24.64,15.75 24.13,15.75 23.62,16.26 23.11,16.26 22.61,16.76 22.1,16.76 21.59,17.27 21.08,17.27 20.57,17.78 20.07,17.78 19.56,18.29 19.05,18.29 18.54,18.8 18.29,18.8 17.53,19.56 7.11,19.56 6.35,20.32 6.35,27.43 6.6,27.69 10.67,27.69 11.18,28.19 15.49,28.19 16,28.7 20.32,28.7 20.83,29.21 25.15,29.21 25.65,29.72 29.97,29.72 30.48,30.23 34.8,30.23 35.31,30.73 39.62,30.73 40.13,31.24 R19.2
GPB0  (via drill 0.4)
  Top 0.254: IC1.1 24.89,25.4 24.38,25.91 v20.57,25.91 | R29.2 47.75,31.75 48.26,32.26 v48.26,38.61
  Bottom 0.254: v48.26,38.61 21.59,38.61 20.57,37.59 v20.57,25.91
GPB1  (via drill 0.4)
  Top 0.254: IC1.2 23.62,22.61 24.13,22.1 25.4,22.1 26.16,22.86 26.16,25.65 24.89,26.92 v22.35,26.92 | R31.2 52.83,31.75 53.34,32.26 v53.34,38.61
  Bottom 0.254: v53.34,38.61 50.29,38.61 49.28,37.59 23.37,37.59 22.35,36.58 v22.35,26.92
GPB2  (via drill 0.4)
  Top 0.254: IC1.3 22.35,22.61 22.61,22.35 23.11,22.35 23.88,21.59 25.65,21.59 26.67,22.61 26.67,26.67 25.4,27.94 v24.13,27.94 | R33.2 57.91,31.75 58.42,32.26 v58.42,38.61
  Bottom 0.254: v58.42,38.61 55.37,38.61 53.59,36.83 25.15,36.83 24.13,35.81 v24.13,27.94
GPB3  (via drill 0.4, 0.5)
  Top 0.254: IC1.4 21.08,22.61 21.34,22.35 21.84,22.35 22.35,21.84 22.86,21.84 23.62,21.08 25.91,21.08 27.18,22.35 27.18,27.69 v26.16,28.7 | R35.2 62.99,31.75 63.5,32.26 v63.5,38.61
  Bottom 0.254: v63.5,38.61 60.96,38.61 58.42,36.07 27.18,36.07 26.16,35.05 v26.16,28.7
GPB4  (via drill 0.4, 0.5)
  Top 0.254: IC1.5 19.81,22.61 20.07,22.35 20.57,22.35 21.08,21.84 21.59,21.84 22.1,21.34 22.61,21.34 23.37,20.57 26.16,20.57 27.69,22.1 v27.69,28.7 | R37.2 68.07,31.75 68.58,32.26 v68.58,38.61
  Bottom 0.254: v68.58,38.61 67.56,38.61 64.26,35.31 28.7,35.31 27.69,34.29 v27.69,28.7
GPB5  (via drill 0.4, 0.5)
  Top 0.254: IC1.6 18.54,22.61 18.8,22.35 19.3,22.35 19.81,21.84 20.32,21.84 20.83,21.34 21.34,21.34 21.84,20.83 22.35,20.83 23.11,20.07 26.42,20.07 28.19,21.84 28.19,26.67 29.46,27.94 v29.46,28.7 | R39.2 73.15,31.75 73.66,32.26 v73.66,38.61
  Bottom 0.254: v73.66,38.61 71.88,38.61 67.82,34.54 30.48,34.54 29.46,33.53 v29.46,28.7
GPB6  (via drill 0.5)
  Top 0.254: IC1.7 17.27,22.61 17.53,22.35 18.03,22.35 18.54,21.84 19.05,21.84 19.56,21.34 20.07,21.34 20.57,20.83 21.08,20.83 21.59,20.32 22.1,20.32 22.86,19.56 26.67,19.56 28.7,21.59 28.7,26.42 v31.24,28.96 | R41.2 78.23,31.75 78.74,32.26 v78.74,38.61
  Bottom 0.254: v78.74,38.61 77.47,38.61 72.64,33.78 36.32,33.78 v31.24,28.96
GPB7
  Top 0.254: IC1.8 16,22.61 16.26,22.35 16.76,22.35 17.27,21.84 17.78,21.84 18.29,21.34 18.8,21.34 19.3,20.83 19.81,20.83 20.32,20.32 20.83,20.32 21.34,19.81 21.84,19.81 22.61,19.05 26.92,19.05 29.21,21.34 29.21,25.4 33.53,29.72 35.05,29.72 35.56,30.23 81.53,30.23 82.04,30.73 R43.2
N$1
  Top 0.406: R1.1 R9.2 3.05,35.05 2.86,35.24 Q1.1
N$2
  Top 0.406: 46.99,49.28 46.99,52.58 | 47.75,54.1 R44.2
  Top 0.61: X3.2 46.99,57.66 47.75,56.9 47.75,54.1 47.75,53.34 46.99,52.58 | 46.99,49.28 47.75,48.51 47.75,43.01 D15.A Q9.3
N$3
  Top 0.406: 10.92,54.1 R20.2
  Top 0.61: X1.4 10.16,57.66 10.92,56.9 10.92,54.1 10.92,52.83 11.43,52.32 11.43,43.69 10.92,43.01 D2.A Q2.3
N$4
  Top 0.406: LED18.A R55.1
N$5
  Top 0.406: 5.84,54.1 R24.2
  Top 0.61: X1.2 5.08,57.66 5.84,56.9 5.84,54.1 5.84,52.58 6.35,52.07 6.35,43.43 5.84,43.01 D1.A | Q1.3 D1.A | D1.A 4.15,40.98
N$6  (via drill 1.02)
  other vias: 60.96,12.7
N$7  (via drill 1.02)
  other vias: 58.42,12.7
N$8
  Top 0.406: Q2.1 7.94,35.24 8.13,35.05 R5.2 R6.1
N$9
  Top 0.406: 16,54.1 R21.2
  Top 0.61: X1.6 15.24,57.66 16,56.9 16,54.1 16,52.83 16.51,52.32 16.51,43.43 16,43.01 D3.A Q3.3
N$10
  Top 0.406: R8.1 R7.2 13.21,35.05 13.02,35.24 Q3.1
N$11
  Top 0.406: 21.08,54.1 R22.2
  Top 0.61: X1.8 20.32,57.66 21.08,56.9 21.08,54.1 21.08,48.77 21.59,48.26 21.59,43.52 D4.A Q4.3
N$12
  Top 0.406: R11.1 R10.2 18.29,35.05 18.1,35.24 Q4.1
N$13
  Top 0.406: 26.16,54.1 R23.2 | 25.15,50.04 25.15,51.56
  Top 0.61: X2.2 25.4,57.66 26.16,56.9 26.16,54.1 26.16,53.34 25.15,52.32 25.15,51.56 | Q5.3 D5.A 26.16,43.01 26.16,48.26 25.15,49.28 25.15,50.04
N$14
  Top 0.406: R13.1 R12.2 23.37,35.9 Q5.1
N$15
  Top 0.406: 31.24,54.1 R25.2 | 30.23,50.04 30.23,51.56
  Top 0.61: X2.4 30.48,57.66 31.24,56.9 31.24,54.1 31.24,53.34 30.23,52.32 30.23,51.56 | Q6.3 D6.A 31.24,43.01 31.24,48.26 30.23,49.28 30.23,50.04
N$16
  Top 0.406: R15.1 R14.2 28.45,35.9 Q6.1
N$17
  Top 0.406: 36.32,54.1 R26.2 | 35.31,50.04 35.31,51.56
  Top 0.61: X2.6 35.56,57.66 36.32,56.9 36.32,54.1 36.32,53.34 35.31,52.32 35.31,51.56 | Q7.3 D7.A 34.38,40.98 36.32,42.93 36.32,48.26 35.31,49.28 35.31,50.04
N$18
  Top 0.406: R17.1 R16.2 33.53,35.9 Q7.1
N$19
  Top 0.406: 41.4,54.1 R27.2 | 40.39,49.53 40.39,52.07
  Top 0.61: X2.8 40.64,57.66 41.4,56.9 41.4,54.1 41.4,53.34 40.39,52.32 40.39,52.07 | Q8.3 D8.A 39.46,40.98 41.4,42.93 41.4,48.26 40.39,49.28 40.39,49.53
N$20
  Top 0.406: R19.1 R18.2 38.61,35.9 Q8.1
N$21
  Top 0.406: R20.1 8.13,54.86 8.38,55.12 9.4,55.12 9.65,55.37 LED2.C
N$22
  Top 0.406: R22.1 18.29,54.86 18.54,55.12 19.56,55.12 19.81,55.37 LED4.C
N$23
  Top 0.406: R21.1 13.21,54.86 13.46,55.12 14.48,55.12 14.73,55.37 LED3.C
N$24
  Top 0.406: R24.1 3.05,54.86 3.3,55.12 4.32,55.12 4.57,55.37 LED1.C
N$25
  Top 0.406: R23.1 23.37,54.86 23.62,55.12 24.64,55.12 24.89,55.37 LED5.C
N$26
  Top 0.406: R25.1 28.45,54.86 28.7,55.12 29.72,55.12 29.97,55.37 LED6.C
N$27
  Top 0.406: R26.1 33.53,54.86 33.78,55.12 34.8,55.12 35.05,55.37 LED7.C
N$28
  Top 0.406: R27.1 38.61,54.86 38.86,55.12 39.88,55.12 40.13,55.37 LED8.C
N$29
  Top 0.406: Q9.1 44.96,35.9 R28.2 R29.1
N$30
  Top 0.406: 52.07,49.28 52.07,52.58 | 52.83,54.1 R45.2
  Top 0.61: X3.4 52.07,57.66 52.83,56.9 52.83,54.1 52.83,53.34 52.07,52.58 | 52.07,49.28 52.83,48.51 52.83,42.93 50.89,40.98 D10.A Q10.3
N$31
  Top 0.406: Q10.1 50.04,35.9 R30.2 R31.1
N$32
  Top 0.406: 57.15,49.02 57.15,52.58 | 57.91,54.1 R46.2
  Top 0.61: X3.6 57.15,57.66 57.91,56.9 57.91,54.1 57.91,53.34 57.15,52.58 | 57.15,49.02 57.91,48.26 57.91,42.93 55.97,40.98 D11.A Q11.3
N$33
  Top 0.406: Q11.1 55.12,35.9 R32.2 R33.1
N$34
  Top 0.406: 62.23,49.28 62.23,52.58 | 62.99,54.1 R47.2
  Top 0.61: X3.8 62.23,57.66 62.99,56.9 62.99,54.1 62.99,53.34 62.23,52.58 | 62.23,49.28 62.99,48.51 62.99,42.93 61.05,40.98 D9.A Q12.3
N$35
  Top 0.406: Q12.1 60.2,35.9 R34.2 R35.1
N$36
  Top 0.406: 68.07,54.1 R48.2
  Top 0.61: X4.2 67.31,57.66 68.07,56.9 68.07,54.1 68.07,52.32 68.58,51.82 68.58,43.43 66.13,40.98 D14.A Q13.3
N$37
  Top 0.406: Q13.1 65.28,35.9 R36.2 R37.1
N$38
  Top 0.406: 73.15,54.1 R49.2
  Top 0.61: X4.4 72.39,57.66 73.15,56.9 73.15,54.1 73.15,52.32 73.66,51.82 73.66,43.43 71.21,40.98 D13.A Q14.3
N$39
  Top 0.406: Q14.1 70.36,35.9 R38.2 R39.1
N$40
  Top 0.406: 78.23,54.1 R50.2
  Top 0.61: X4.6 77.47,57.66 78.23,56.9 78.23,54.1 78.23,52.32 78.74,51.82 78.74,43.43 76.29,40.98 D12.A Q15.3
N$41
  Top 0.406: Q15.1 75.44,35.9 R40.2 R41.1
N$42
  Top 0.406: 83.31,54.1 R51.2
  Top 0.61: X4.8 82.55,57.66 83.31,56.9 83.31,54.1 83.31,52.32 83.82,51.82 83.82,43.43 81.37,40.98 D16.A Q16.3
N$43
  Top 0.406: Q16.1 80.52,35.9 R42.2 R43.1
N$44
  Top 0.406: LED9.C 46.48,55.37 46.23,55.12 45.21,55.12 44.96,54.86 R44.1
N$45
  Top 0.406: LED10.C 51.56,55.37 51.31,55.12 50.29,55.12 50.04,54.86 R45.1
N$46
  Top 0.406: LED11.C 56.64,55.37 56.39,55.12 55.37,55.12 55.12,54.86 R46.1
N$47
  Top 0.406: LED12.C 61.72,55.37 61.47,55.12 60.45,55.12 60.2,54.86 R47.1
N$48
  Top 0.406: LED13.C 66.8,55.37 66.55,55.12 65.53,55.12 65.28,54.86 R48.1
N$49
  Top 0.406: LED14.C 71.88,55.37 71.63,55.12 70.61,55.12 70.36,54.86 R49.1
N$50
  Top 0.406: LED16.C 82.04,55.37 81.79,55.12 80.77,55.12 80.52,54.86 R51.1
N$51
  Top 0.406: LED15.C 76.96,55.37 76.71,55.12 75.69,55.12 75.44,54.86 R50.1
N$52
  Top 0.406: LED17.A R52.1
N$53  (via drill 1.02)
  other vias: 55.88,12.7
N$54  (via drill 1.02)
  other vias: 53.34,12.7
N$55  (via drill 1.02)
  other vias: 50.8,12.7
N$56  (via drill 1.02)
  other vias: 48.26,12.7
N$57  (via drill 1.02)
  other vias: 60.96,15.24
N$58  (via drill 1.02)
  other vias: 58.42,15.24
N$59  (via drill 1.02)
  other vias: 55.88,15.24
N$60  (via drill 1.02)
  other vias: 53.34,15.24
N$61  (via drill 1.02)
  other vias: 50.8,15.24
N$62  (via drill 1.02)
  other vias: 48.26,15.24
N$63  (via drill 1.02)
  other vias: 60.96,17.78
N$64  (via drill 1.02)
  other vias: 58.42,17.78
N$65  (via drill 1.02)
  other vias: 55.88,17.78
N$66  (via drill 1.02)
  other vias: 53.34,17.78
N$67  (via drill 1.02)
  other vias: 50.8,17.78
N$68  (via drill 1.02)
  other vias: 48.26,17.78
N$69  (via drill 1.02)
  other vias: 45.72,20.32
N$70  (via drill 1.02)
  other vias: 43.18,20.32
N$71  (via drill 1.02)
  other vias: 40.64,20.32
N$72  (via drill 1.02)
  other vias: 38.1,20.32
N$73  (via drill 1.02)
  other vias: 35.56,20.32
N$74  (via drill 1.02)
  other vias: 33.02,20.32
N$75  (via drill 1.02)
  other vias: 30.48,20.32
N$76  (via drill 1.02)
  other vias: 60.96,20.32
N$77  (via drill 1.02)
  other vias: 58.42,20.32
N$78  (via drill 1.02)
  other vias: 55.88,20.32
N$79  (via drill 1.02)
  other vias: 53.34,20.32
N$80  (via drill 1.02)
  other vias: 50.8,20.32
N$81  (via drill 1.02)
  other vias: 48.26,20.32
N$82  (via drill 1.02)
  other vias: 81.28,17.78
N$83  (via drill 1.02)
  other vias: 78.74,17.78
N$84  (via drill 1.02)
  other vias: 76.2,17.78
N$85  (via drill 1.02)
  other vias: 73.66,17.78
N$86  (via drill 1.02)
  other vias: 71.12,17.78
N$87  (via drill 1.02)
  other vias: 81.28,20.32
N$88  (via drill 1.02)
  other vias: 78.74,20.32
N$89  (via drill 1.02)
  other vias: 76.2,20.32
N$90  (via drill 1.02)
  other vias: 73.66,20.32
N$91  (via drill 1.02)
  other vias: 45.72,12.7
N$92  (via drill 1.02)
  other vias: 43.18,12.7
N$93  (via drill 1.02)
  other vias: 40.64,12.7
N$94  (via drill 1.02)
  other vias: 38.1,12.7
N$95  (via drill 1.02)
  other vias: 35.56,12.7
N$96  (via drill 1.02)
  other vias: 33.02,12.7
N$97  (via drill 1.02)
  other vias: 30.48,12.7
N$98  (via drill 1.02)
  other vias: 71.12,20.32
N$99  (via drill 1.02)
  other vias: 81.28,22.86
N$100  (via drill 1.02)
  other vias: 78.74,22.86
N$101  (via drill 1.02)
  other vias: 76.2,22.86
N$102  (via drill 1.02)
  other vias: 73.66,22.86
N$103  (via drill 1.02)
  other vias: 71.12,22.86
N$104  (via drill 1.02)
  other vias: 81.28,25.4
N$105  (via drill 1.02)
  other vias: 78.74,25.4
N$106  (via drill 1.02)
  other vias: 76.2,25.4
N$107  (via drill 1.02)
  other vias: 45.72,15.24
N$108  (via drill 1.02)
  other vias: 43.18,15.24
N$109  (via drill 1.02)
  other vias: 40.64,15.24
N$110  (via drill 1.02)
  other vias: 38.1,15.24
N$111  (via drill 1.02)
  other vias: 35.56,15.24
N$112  (via drill 1.02)
  other vias: 33.02,15.24
N$113  (via drill 1.02)
  other vias: 30.48,15.24
N$114  (via drill 1.02)
  other vias: 73.66,25.4
N$115  (via drill 1.02)
  other vias: 71.12,25.4
N$116  (via drill 1.02)
  other vias: 68.58,17.78
N$117  (via drill 1.02)
  other vias: 66.04,17.78
N$118  (via drill 1.02)
  other vias: 63.5,17.78
N$119  (via drill 1.02)
  other vias: 68.58,20.32
N$120  (via drill 1.02)
  other vias: 66.04,20.32
N$121  (via drill 1.02)
  other vias: 63.5,20.32
N$122  (via drill 1.02)
  other vias: 60.96,22.86
N$123  (via drill 1.02)
  other vias: 45.72,17.78
N$124  (via drill 1.02)
  other vias: 43.18,17.78
N$125  (via drill 1.02)
  other vias: 40.64,17.78
N$126  (via drill 1.02)
  other vias: 38.1,17.78
N$127  (via drill 1.02)
  other vias: 35.56,17.78
N$128  (via drill 1.02)
  other vias: 33.02,17.78
N$129  (via drill 1.02)
  other vias: 30.48,17.78
N$130  (via drill 1.02)
  other vias: 58.42,22.86
N$131  (via drill 1.02)
  other vias: 55.88,22.86
N$132  (via drill 1.02)
  other vias: 53.34,22.86
N$133  (via drill 1.02)
  other vias: 60.96,25.4
N$134  (via drill 1.02)
  other vias: 58.42,25.4
N$135  (via drill 1.02)
  other vias: 55.88,25.4
N$136  (via drill 1.02)
  other vias: 53.34,25.4
N$137  (via drill 1.02)
  other vias: 68.58,22.86
N$138  (via drill 1.02)
  other vias: 66.04,22.86
N$139  (via drill 1.02)
  other vias: 63.5,22.86
N$140  (via drill 1.02)
  other vias: 68.58,25.4
N$141  (via drill 1.02)
  other vias: 66.04,25.4
N$142  (via drill 1.02)
  other vias: 63.5,25.4
N$143  (via drill 1.02)
  other vias: 45.72,22.86
N$144  (via drill 1.02)
  other vias: 43.18,22.86
N$145  (via drill 1.02)
  other vias: 50.8,22.86
N$146  (via drill 1.02)
  other vias: 48.26,22.86
N$147  (via drill 1.02)
  other vias: 81.28,27.94
N$148  (via drill 1.02)
  other vias: 78.74,27.94
N$149  (via drill 1.02)
  other vias: 76.2,27.94
N$150  (via drill 1.02)
  other vias: 73.66,27.94
N$151  (via drill 1.02)
  other vias: 40.64,22.86
N$152  (via drill 1.02)
  other vias: 38.1,22.86
N$153  (via drill 1.02)
  other vias: 35.56,22.86
N$154  (via drill 1.02)
  other vias: 33.02,22.86
N$155  (via drill 1.02)
  other vias: 71.12,27.94
N$156  (via drill 1.02)
  other vias: 60.96,27.94
N$157  (via drill 1.02)
  other vias: 58.42,27.94
N$158  (via drill 1.02)
  other vias: 55.88,27.94
N$159  (via drill 1.02)
  other vias: 53.34,27.94
N$160  (via drill 1.02)
  other vias: 68.58,27.94
N$161  (via drill 1.02)
  other vias: 66.04,27.94
N$162  (via drill 1.02)
  other vias: 63.5,27.94
N$163  (via drill 1.02)
  other vias: 45.72,25.4
N$164  (via drill 1.02)
  other vias: 43.18,25.4
N$165  (via drill 1.02)
  other vias: 50.8,25.4
N$166  (via drill 1.02)
  other vias: 48.26,25.4
N$167  (via drill 1.02)
  other vias: 40.64,25.4
N$168  (via drill 1.02)
  other vias: 38.1,25.4
N$169  (via drill 1.02)
  other vias: 35.56,25.4
N$170  (via drill 1.02)
  other vias: 33.02,25.4
N$171  (via drill 1.02)
  other vias: 45.72,27.94
N$172  (via drill 1.02)
  other vias: 43.18,27.94
N$173  (via drill 1.02)
  other vias: 50.8,27.94
N$174  (via drill 1.02)
  other vias: 48.26,27.94
N$175  (via drill 1.02)
  other vias: 40.64,27.94
N$176  (via drill 1.02)
  other vias: 38.1,27.94
N$177  (via drill 1.02)
  other vias: 35.56,27.94
N$178  (via drill 1.02)
  other vias: 43.18,10.16
N$179  (via drill 1.02)
  other vias: 40.64,10.16
N$180  (via drill 1.02)
  other vias: 38.1,10.16
N$181  (via drill 1.02)
  other vias: 35.56,10.16
N$182  (via drill 1.02)
  other vias: 33.02,10.16
N$183  (via drill 1.02)
  other vias: 30.48,10.16
N$184  (via drill 1.02)
  other vias: 45.72,10.16
N$185  (via drill 1.02)
  other vias: 60.96,10.16
N$186  (via drill 1.02)
  other vias: 58.42,10.16
N$187  (via drill 1.02)
  other vias: 55.88,10.16
N$188  (via drill 1.02)
  other vias: 53.34,10.16
N$189  (via drill 1.02)
  other vias: 50.8,10.16
N$190  (via drill 1.02)
  other vias: 48.26,10.16
N$191  (via drill 1.02)
  other vias: 63.5,12.7
N$192  (via drill 1.02)
  other vias: 63.5,15.24
N$193  (via drill 1.02)
  other vias: 63.5,10.16
RESET
  Top 0.406: IC1.18 12.19,12.95 15.11,10.03 S1.3 S1.4 18.16,3.43 19.05,2.54 POWER.1
VIN
  Bottom 0.61: JP4.2 68.07,8.38 67.06,7.37 47.24,7.37 45.97,6.1 POWER.6

### Text on the board
tPlace: 1 | 2 | 3 | 4 | 5 | 6 | 7 | 8 | 9 | 10 | 11 | 12 | 13 | 14 | 15 | 16 | freetronics | AREF | GND | D13 | D12 | D11 | D10 | D8 | D6 | D4 | D2 | D0 | www.freetronics.com | D9 | D7 | D5 | D3 | D1 | Relay Driver Shield v1.0 | www.freetronics.com/relayshield | 12Vdc IN | 12V | 3V3 | GND | VIN | A1 | A3 | A5 | 5V | 0 | 1 | 2 | RST | 5V | GND | A0 | A2 | A4 | I2C ADDR | RESET
bPlace: AREF | GND | D13 | D12 | D11 | D10 | D8 | D6 | D4 | D2 | D0 | D9 | D7 | D5 | D3 | D1 | Relay Driver Shield v1.0 | (c) 2011 Freetronics Pty Ltd | by Jonathan Oxer | Licensed under the TAPR | Open Hardware License | SKU: RELAYSHIELD | www.tapr.org/OHL | www.freetronics.com/relayshield | freetronics | www.freetronics.com | 3V3 | GND | VIN | A1 | A3 | A5 | RST | 5V | GND | A0 | A2 | A4